# Altium schematic sheet COM_SPI.SchDoc
size A4
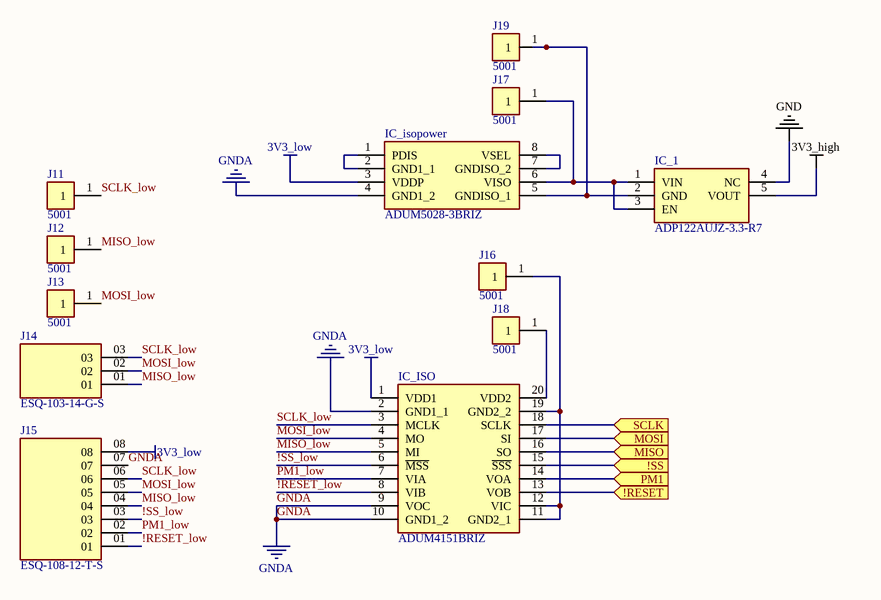
[diagram p0: COM_SPI.SchDoc]

## Parts
IC_1  ADP122AUJZ-3.3-R7  [SOT95P280X100-5N]
IC_ISO  ADUM4151BRIZ  [SOIC127P1031X264-20N]
IC_isopower  ADUM5028-3BRIZ  [SOIC127P1031X265-8N]
J11  5001  [KEYSTONE_5001]
J12  5001  [KEYSTONE_5001]
J13  5001  [KEYSTONE_5001]
J14  ESQ-103-14-G-S  [SAMTEC_ESQ-103-14-G-S]
J15  ESQ-108-12-T-S  [SAMTEC_ESQ-108-12-T-S]
J16  5001  [KEYSTONE_5001]
J17  5001  [KEYSTONE_5001]
J18  5001  [KEYSTONE_5001]
J19  5001  [KEYSTONE_5001]

## Ports
!RESET (in), !SS (in), MISO (in), MOSI (in), PM1 (in), SCLK (in)

## Nets
3V3_high: IC_1.5(VOUT)
3V3_low: IC_ISO.1(VDD1) IC_isopower.3(VDDP) J15.08
GND: IC_1.4(NC)
GNDA: IC_ISO.2(GND1_1) IC_ISO.9(VOC) IC_ISO.10(GND1_2) IC_isopower.4(GND1_2) J15.07
!RESET: IC_ISO.13(VOB) ; port !RESET
!RESET_low: IC_ISO.8(VIB) J15.01
!SS: IC_ISO.15(~{SSS}) ; port !SS
!SS_low: IC_ISO.6(~{MSS}) J15.03
MISO: IC_ISO.16(SO) ; port MISO
MISO_low: IC_ISO.5(MI) J12.1 J14.01 J15.04
MOSI: IC_ISO.17(SI) ; port MOSI
MOSI_low: IC_ISO.4(MO) J13.1 J14.02 J15.05
PM1: IC_ISO.14(VOA) ; port PM1
PM1_low: IC_ISO.7(VIA) J15.02
SCLK: IC_ISO.18(SCLK) ; port SCLK
SCLK_low: IC_ISO.3(MCLK) J11.1 J14.03 J15.06
NetIC_1_1: IC_1.1(VIN) IC_1.3(EN) IC_isopower.6(VISO) J17.1
NetIC_1_2: IC_1.2(GND) IC_isopower.5(GNDISO_1) J19.1
NetIC_ISO_11: IC_ISO.11(GND2_1) IC_ISO.12(VIC) IC_ISO.19(GND2_2) J16.1
NetIC_ISO_20: IC_ISO.20(VDD2) J18.1
NetIC_isopower_1: IC_isopower.1(PDIS) IC_isopower.2(GND1_1)
NetIC_isopower_7: IC_isopower.7(GNDISO_2) IC_isopower.8(VSEL)

## Library data of the parts
IC_1 = ADP122AUJZ-3.3-R7: Integrated Circuit; Manufacturer_Name: Analog Devices; Datasheet Link: http://uk.rs-online.com/web/p/products/9128071; Height: 1mm; Manufacturer_Part_Number: ADP122AUJZ-3.3-R7; Arrow Part Number: ADP122AUJZ-3.3-R7; Arrow Price/Stock: https://www.arrow.com/en/products/adp122aujz-3.3-r7/analog-devices; Mouser Part Number: 584-ADP122AUJZ-3.3R7; Mouser Price/Stock: https://www.mouser.co.uk/ProductDetail/Analog-Devices/ADP122AUJZ-33-R7?qs=BpaRKvA4VqERsawSFjb%252Blw%3D%3D
IC_ISO = ADUM4151BRIZ: Integrated Circuit; Manufacturer_Name: Analog Devices; Datasheet Link: http://www.analog.com/media/en/technical-documentation/data-sheets/ADuM4151_4152_4153.pdf; Height: 2.64mm; Manufacturer_Part_Number: ADUM4151BRIZ; Arrow Part Number: ADUM4151BRIZ; Arrow Price/Stock: https://www.arrow.com/en/products/adum4151briz/analog-devices; Mouser Part Number: 584-ADUM4151BRIZ; Mouser Price/Stock: https://www.mouser.co.uk/ProductDetail/Analog-Devices/ADUM4151BRIZ?qs=iCT64eccu7hBfyU9ooJLRg%3D%3D
IC_isopower = ADUM5028-3BRIZ: Integrated Circuit; Manufacturer_Name: Linear Technology; Datasheet Link: https://componentsearchengine.com/Datasheets/1/ADUM5028-3BRIZ.pdf; Height: 2.65mm; Manufacturer_Part_Number: ADUM5028-3BRIZ; Mouser Part Number: 584-ADUM5028-3BRIZ; Mouser Price/Stock: https://www.mouser.com/Search/Refine.aspx?Keyword=584-ADUM5028-3BRIZ
J11-J13 J16-J19 = 5001: Conn Test Point SKT 1 POS ST Thru-Hole 1 Port; MF: Keystone Electronics Corp.; SnapEDA_Link: https://www.snapeda.com/parts/5001/Keystone%20Electronics/view-part/4775115/?ref=snap; Purchase-URL: https://pricing.snapeda.com/search/part/5001/?ref=eda; Value: *; Availability: Good; MP: 5001; Price: None; Package: None; Check_prices: https://www.snapeda.com/parts/5001/Keystone%20Electronics/view-part/4775115/?ref=eda
J14 = ESQ-103-14-G-S: Conn Elevated Socket SKT 3 POS 2.54mm Solder ST Top Entry Thru-Hole Bulk; MF: Samtec; SnapEDA_Link: https://www.snapeda.com/parts/ESQ-103-14-G-S/Samtec/view-part/3463809/?ref=snap; MP: ESQ-103-14-G-S; Availability: Bad; Price: None; Value: *; Package: None
J15 = ESQ-108-12-T-S: Conn Elevated Socket SKT 8 POS 2.54mm Solder ST Top Entry Thru-Hole Tube; MF: Samtec; MP: ESQ-108-12-T-S; Price: None; SnapEDA_Link: https://www.snapeda.com/parts/ESQ-108-12-T-S/Samtec/view-part/3520893/?ref=snap; Package: None; Toby_UK-Purchase-URL: https://snapeda.com/shop?store=Toby+UK&id=3520893; Value: *; Availability: Bad